# EAGLE design ledstringpower (EAGLE 9.6.2)
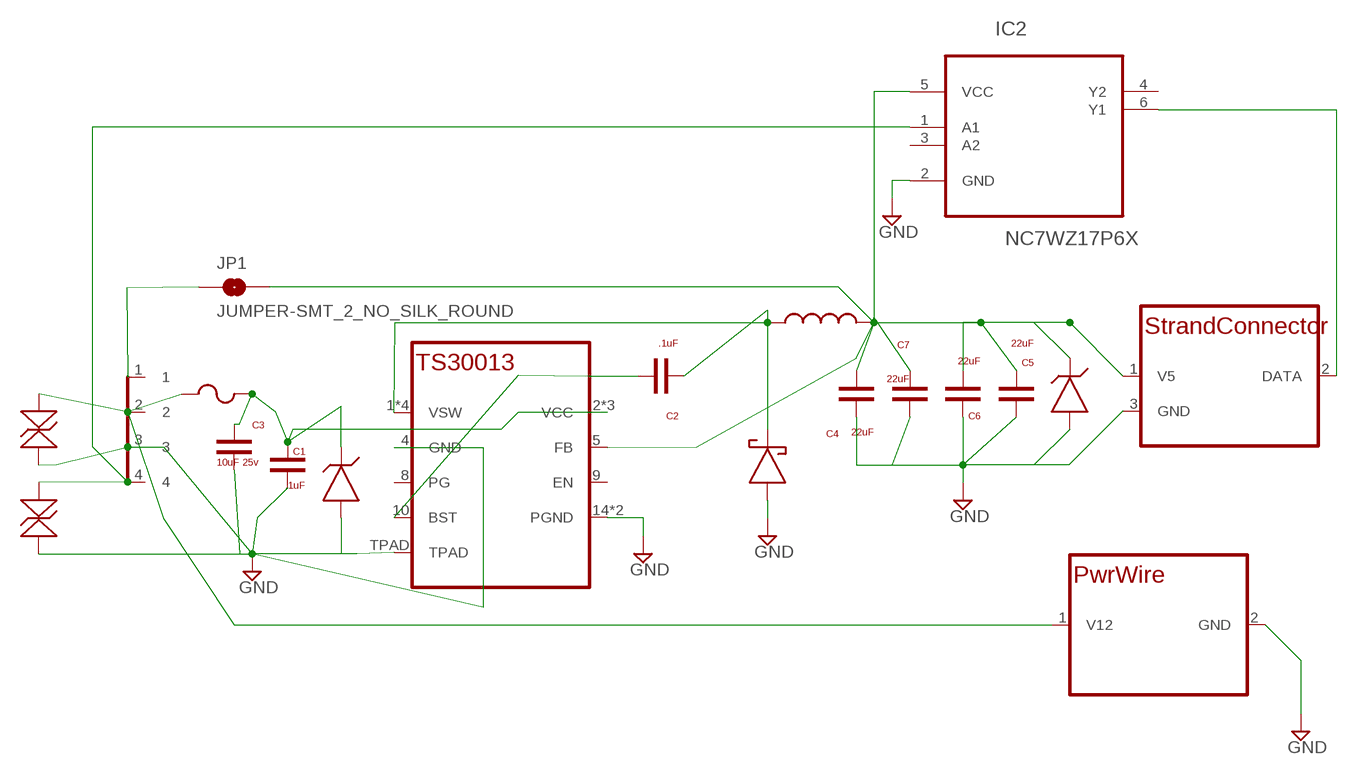
[diagram p0: schematic, sheet 1]

## Parts
C1  .1uF  CAPACITOR_NONPOLARC0603  [C0603]
C2  .1uF  CAPACITOR_NONPOLARC0603  [C0603]
C3  10uF 25v  CL31A106MAHNNNEC1206  [C1206]
C4  22uF  GRM188R61A226ME15DC0603  [C0603]
C5  22uF  GRM188R61A226ME15DC0603  [C0603]
C6  22uF  GRM188R61A226ME15DC0603  [C0603]
C7  22uF  GRM188R61A226ME15DC0603  [C0603]
D2  LS54LS54  [LS54]
F1  3A  FUSER0603  [R0603]
IC1  TS30013QFN16-3X3-DIY  [QFN16-3X3-DIY]
IC2  NC7WZ17P6X  [SOT65P210X110-6N]
JP1  JUMPER-SMT_2_NO_SILK_ROUND  [SMT-JUMPER_2_NO_SILK_ROUND]
L1  SRN5040TA-4R7MSRN5040TA  [SRN5040TA]
TVS1  DESD5V0U1BL-7BDFN1006-2  [DFN1006-2]
TVS2  DESD5V0U1BL-7BDFN1006-2  [DFN1006-2]
U$3  TE-1969806-1TE-1969806-1  [TE-1969806-1]
U$5  LEDSTRANDDLEDWIREP  [LEDWIREP]
U$8  PWRWIREDPWRWIREP  [PWRWIREP]
Z1  1SMB5930BT3G1SMB5930BT3G  [1SMB5930BT3G]
Z2  MMSZ5231BT3G-5V1-ZENERSOD123  [SOD123]

## Nets
DATA: IC2.1(A1) TVS2.2 U$3.4
GND: C1.1 C3.2 C4.1 C5.1 C6.1 C7.1 D2.1 IC1.4(GND) IC1.14(PGND) IC1.15(PGND) IC1.TPAD IC2.2(GND) TVS1.1 TVS2.1 U$3.3 U$5.3(GND) U$8.2(GND) Z1.1 Z2.1
N$1: IC2.6(Y1) U$5.2(DATA)
N$3: C2.1 D2.2 IC1.1(VSW) IC1.12(VSW) IC1.13(VSW) IC1.16(VSW) L1.1
N$5: C2.2 IC1.10(BST)
N$7: JP1.1 U$3.1
V5: C4.2 C5.2 C6.2 C7.2 IC1.5(FB) IC2.5(VCC) JP1.2 L1.2 U$5.1(V5) Z2.2
V12: F1.1 TVS1.2 U$3.2 U$8.1(V12)
VCC: C1.2 C3.1 F1.2 IC1.2(VCC) IC1.3(VCC) IC1.11(VCC) Z1.2
Unconnected: IC1.8(PG) IC1.9(EN) IC2.3(A2) IC2.4(Y2)

## Library data of the parts
C1 C2 = ledinlinesupply:CAPACITOR_NONPOLAR
C3 = ledinlinesupply:CL31A106MAHNNNE
C4-C7 = ledinlinesupply:GRM188R61A226ME15D
D2 = ledinlinesupply:LS54
F1 = ledinlinesupply:FUSE
IC1 = ledinlinesupply:TS30013
IC2 = NC7WZ17P6X_dual_schmitt_buffer:NC7WZ17P6X: Dual Buffer; MPN: NC7WZ17P6X; OC_FARNELL: 1651986; OC_NEWARK: 38C7625; PACKAGE: SC-70-6; SUPPLIER: FAIRCHILD SEMICONDUCTOR
JP1 = SparkFun-Jumpers:JUMPER-SMT_2_NO: Normally open jumper This jumper has two pads in close proximity to each other. Apply solder to close the connection. Round pads are easier to solder for beginners, but are a lot larger. SparkFun Product that uses the round pads: SparkFun EL Sequencer <https://www.sparkfun.com/products/12781>
L1 = ledinlinesupply:SRN5040TA-4R7M
TVS1 TVS2 = ledinlinesupply:DESD5V0U1BL-7B
U$3 = ledinlinesupply:TE-1969806-1
U$5 = ledinlinesupply:LEDSTRANDD
U$8 = ledinlinesupply:PWRWIRED
Z1 = ledinlinesupply:1SMB5930BT3G
Z2 = ledinlinesupply:MMSZ5231BT3G-5V1-ZENER

## Board
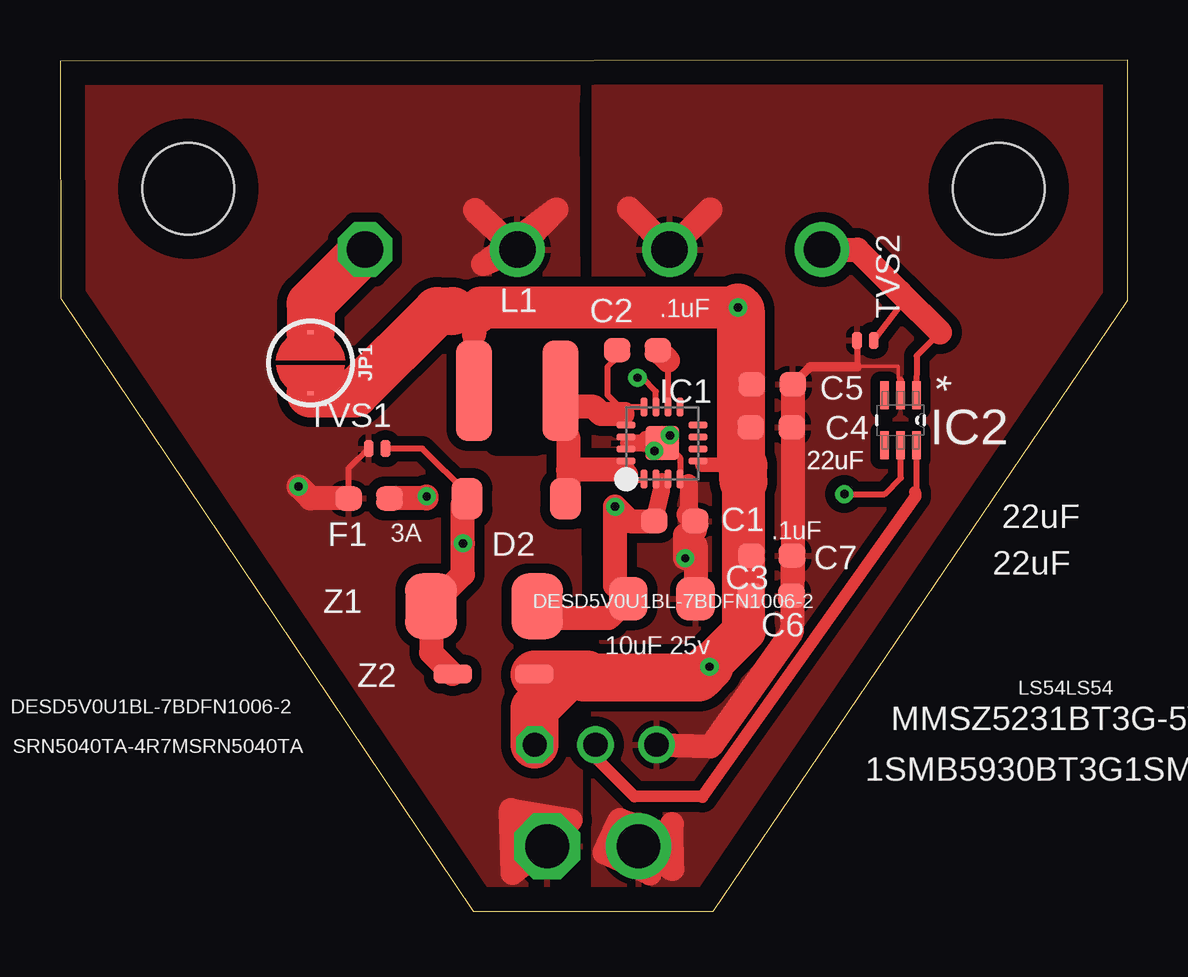
[diagram p1: board, top side]
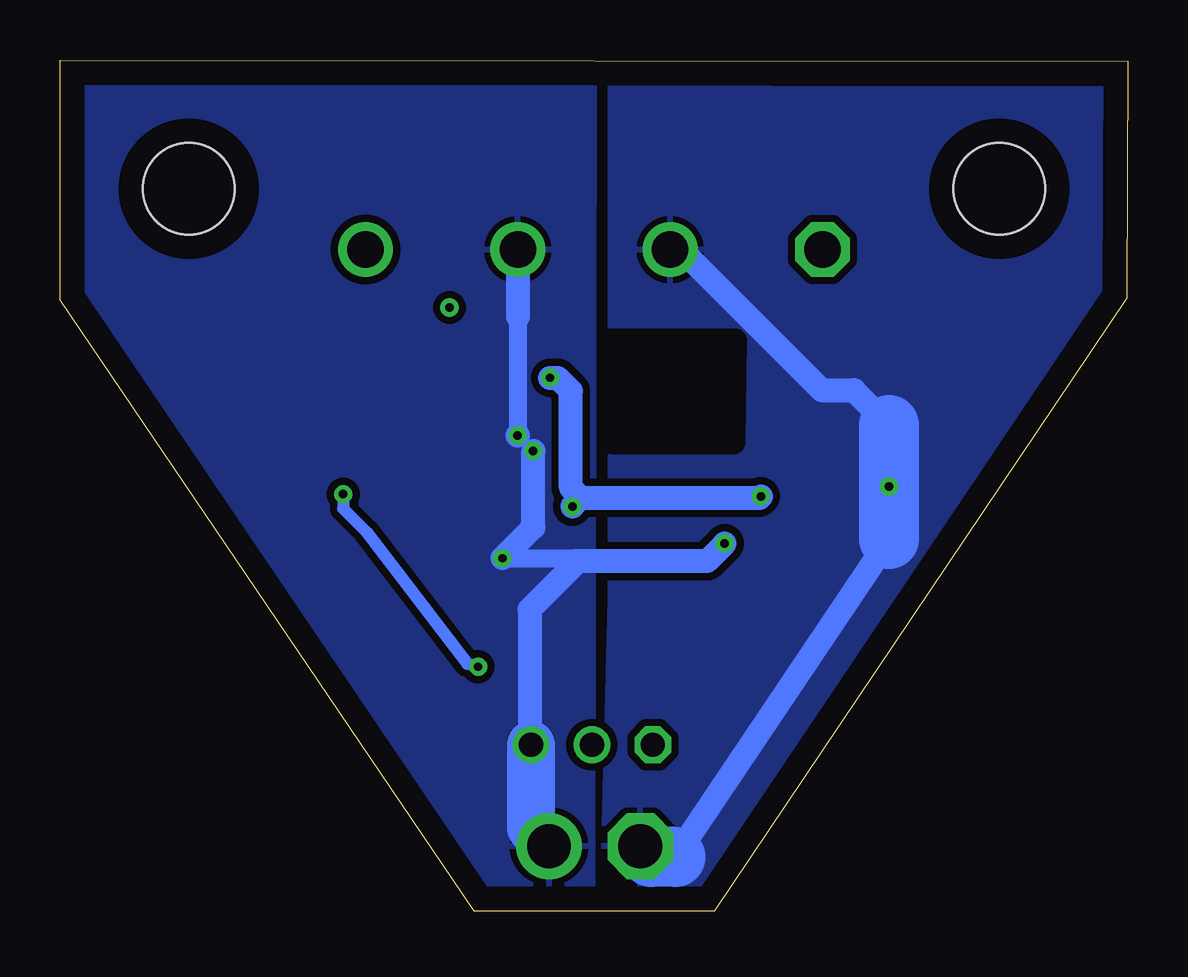
[diagram p2: board, bottom side, seen from below]

Size 44.48 x 35.47 mm. Coordinates in mm from the lower left corner, seen from the top.
Outline: 17.21,0 27.21,0 44.48,25.47 44.48,35.47 0,35.41 0.03,25.55 17.21,0
Copper layers (1*16): Top 0.035mm / dielectric 1.5mm / Bottom 0.035mm
Design rules "default": minimum track width 6mil, minimum drill 0.35mm, track to track 6mil, track to pad 6mil, pad to pad 6mil, via to via 6mil, smd to smd 6mil, copper to edge 40mil, drill to drill 6mil, minimum pad ring 10mil, minimum via ring 8mil, stop-mask expansion 4mil, vias tented up to drill 0mil, thermal gap 10mil
tRestrict: area 18.2,19.6 to 19.8,23.8
bRestrict: area 16.4,19.5 to 21.5,23.8

### Footprints (pad centres in the part's own frame; a part is rotated, then mirrored left to right if it is on the bottom)
C0603 = smd 1.1 x 1: 1 -0.85,0; 2 0.85,0
C1206 = smd 1.6 x 1.8: 1 -1.4,0; 2 1.4,0
LS54 = smd 1.3 x 1.75: 1 -2.05,0; 2 2.05,0
R0603 = smd 1.1 x 1: 1 -0.85,0; 2 0.85,0
QFN16-3X3-DIY = smd 0.8 x 0.3: 1 -1.5,0.75; 2 -1.5,0.25; 3 -1.5,-0.25; 4 -1.5,-0.75; 9 1.5,-0.75; 10 1.5,-0.25; 11 1.5,0.25; 12 1.5,0.75 | smd 0.3 x 0.8: 5 -0.75,-1.5; 6 -0.25,-1.5; 7 0.25,-1.5; 8 0.75,-1.5; 13 0.75,1.5; 14 0.25,1.5; 15 -0.25,1.5; 16 -0.75,1.5 | smd 1.4 x 1.4: TPAD 0,0
SOT65P210X110-6N = smd 1.168 x 0.356: 1 -1.041,0.66; 2 -1.041,0; 3 -1.041,-0.66; 4 1.041,-0.66; 5 1.041,0; 6 1.041,0.66
SMT-JUMPER_2_NO_SILK_ROUND = smd 0.152 x 0.305: 1 -1.27,0; 2 1.27,0
SRN5040TA = smd 1.5 x 4.2: 1 -1.8,0; 2 1.8,0
DFN1006-2 = smd 0.4 x 0.7: 1 -0.35,0; 2 0.35,0
TE-1969806-1 = drill 1.52 octagon: 1 -9.525,0 | drill 1.52: 2 -3.175,0; 3 3.175,0; 4 9.525,0 | hole 3.81: -16.89,2.54; 16.89,2.54
LEDWIREP = drill 1.016 octagon: 1 -2.54,0 | drill 1.016: 2 0,0; 3 2.54,0
PWRWIREP = drill 1.829 octagon: 1 -1.905,0 | drill 1.829: 2 1.905,0
1SMB5930BT3G = smd 2.159 x 2.743: 1 -2.21,0; 2 2.21,0
SOD123 = smd 1.6 x 0.8: 1 -1.7,0; 2 1.7,0

### Placement (x,y rotation side)
C1  25.61,16.26 180 top
C2  24.06,23.38 0 top
C3  25.08,13.03 0 top
C4  29.64,20.17 180 top
C5  29.68,21.96 180 top
C6  29.63,13.15 180 top
C7  29.65,14.82 180 top
D2  19.01,17.19 0 top
F1  12.88,17.2 0 top
IC1  25.09,19.51 90 top
IC2  35.02,20.46 270 top
JP1  10.44,22.85 270 top
L1  19.05,21.69 180 top
TVS1  13.21,19.28 180 top
TVS2  33.56,23.79 0 top
U$3  22.23,27.57 0 top
U$5  22.32,6.94 0 top
U$8  22.2,2.71 0 top
Z1  17.67,12.71 0 top
Z2  18.06,9.88 0 top

### Tracks (layer width: path | path; a pad name or v marks a point on that pad's centre or on a via)
DATA
  Top 0.25: 36.67,24.12 35.69,23.14 IC2.1 | 35,25.8 35,25.21 TVS2.2
  Top 1: U$3.4 33.22,27.57 35,25.8 36.67,24.12
GND  (via drill 0.35)
  Top 0.152: 35.01,22.15 34.92,22.24 34.92,22.72 32.56,22.72 32.52,22.68
  Top 0.2: IC1.TPAD 24.84,19.26 IC1.15
  Top 0.25: IC1.15 23.59,19.52 IC1.14 24.38,19.76 | 25.67,19.06 25.84,18.89 IC1.4 26.02,18.01 26.19,17.84 | TVS2.1 33.21,22.68 | 35.02,22.14 35.01,22.15 | D2.1 16.96,17.42 15.1,19.28 TVS1.1 | C6.1 30.48,14.8 C7.1 30.5,13.87 30.54,13.83
  Top 0.3: 35.02,22.14 IC2.2
  Top 0.4: C5.1 31.25,22.68 32.52,22.68 33.21,22.68
  Top 0.5: IC1.TPAD 24.63,19.51 24.38,19.76 24.14,19.52 23.59,19.52
  Top 0.75: 26.19,17.84 26.19,16.53
  Top 1: 26.15,15.58 26.46,15.89 C1.1 26.19,16.53 | v26.05,14.71 26.05,15.68 26.15,15.58 | D2.1 16.79,17.02 v16.79,15.33 16.79,14.04 Z1.1 15.46,10.78 Z2.1 | 26.15,15.58 26.48,15.25 C3.2 | C5.1 30.53,20.21 C4.1 30.54,20.12 30.54,13.83 | U$5.3 24.88,6.92 27.11,6.86 30.48,11.63 30.5,12.18 C7.1 | U$3.3 27.09,29.25 27.11,29.25 25.43,27.57 U$3.3 | U$3.3 23.71,29.27 23.71,29.28 25.4,27.59 U$3.3 | U$8.2 25.52,1.76 25.49,3.63 24.58,1.58 22.69,2.44 23.33,3.8 24.99,3.29 23.57,2.99 U$8.2
  Bottom 0.2: v25.41,19.83 v24.77,19.19
  Bottom 0.75: v26.05,14.71 23.02,14.71 22.9,14.59 | 25.4,24.77 v25.4,19.83 | v24.76,19.19 v24.77,19.19
  Bottom 1: U$3.3 25.4,24.77 | v16.79,15.33 v16.79,15.32 17.52,14.59 22.9,14.59 24.91,12.58 24.91,6.99 U$5.3 | v26.05,14.71 24.76,16 v24.76,19.19 | v25.4,19.83 v25.41,19.83
  Bottom 2: U$5.3 24.86,3.47 U$8.2
  pour Bottom (isolate 0.305): 22.23,35.13 22.3,0.7 27.1,0.7 44.01,25.73 44.01,35 43.68,34.98 43.03,34.98
  pour Top (isolate 0.406): 22.26,35.26 44.21,35.23 44.21,25.56 27.16,0.32 22.23,0.32
N$1
  Top 0.25: IC2.6 35.68,17.52 35.63,17.47
  Top 0.5: 35.63,17.47 35.64,17.28 26.77,4.77 23.93,4.79 22.32,6.4 U$5.2
N$3
  Top 0.25: IC1.13 23.57,20.28 23.57,20.86 23.57,21.01 IC1.12 23.32,21.01 22.81,21.52 22.81,22.68 23.21,23.08 C2.1 | IC1.16 23.59,18.2 23.59,17.99 24.32,17.99 IC1.1
  Top 0.3: 21.17,19.77 21.17,21.37 L1.1 21.52,21.02
  Top 0.7: 23.57,20.86 23.43,20.72
  Top 1: D2.2 21.17,17.3 21.17,18.39 | 21.17,19.77 21.17,18.39 | 23.43,20.72 22.55,20.72 22.25,21.02 21.52,21.02 | 23.59,18.2 23.4,18.39 21.17,18.39
N$5
  Top 0.25: IC1.10 25.34,22.95
  Top 1: 25.34,22.95 C2.2
N$7
  Top 2: U$3.1 10.44,25.3 JP1.1
V5  (via drill 0.35)
  Top 0.25: IC1.5 | 28.36,18.69 28.45,18.61 | v32.68,17.38 34.36,17.38 35.04,18.06 35.04,19.4 IC2.5 | 28.25,18.8 28.25,19.63 C4.2 28.79,21.92 C5.2 | C7.2 28.8,13.17 C6.2 28.54,11.5 27.43,10.19 v27.06,10.19
  Top 0.3: 17.06,24.3 16.35,25.01 | IC1.5 26.77,18.61
  Top 0.5: L1.2 17.25,24.84 | 17.25,24.04 L1.2 | L1.2 17.06,21.88 17.06,24.3
  Top 0.6: 26.77,18.61 28.45,18.61
  Top 0.75: 28.25,18.8 28.28,18.77 28.45,18.61 28.47,18.58
  Top 1: U$5.1 19.78,9.86 Z2.2 | 17.25,24.84 17.25,24.04
  Top 1.75: 17.25,24.84 17.57,25.16 v28.25,25.16
  Top 1.8: 28.47,17.91 28.47,11.74 28.52,11.7 27.06,10.24 v27.06,10.19
  Top 2: v28.25,25.16 28.36,25.05 28.36,18.69 | 28.47,18.58 28.47,17.92 28.47,17.91 | v27.06,10.19 26.61,9.74 21.83,9.74 21.95,9.86 21.2,9.86 | 21.2,9.86 19.78,9.86 | U$5.1 19.78,8.44 21.2,9.86 | 16.35,25.01 15.73,25.01 15.72,25.01 15.71,25.01 12.28,21.58 JP1.2
  Bottom 0.5: v27.06,10.19 27.51,10.31 31.72,15.82 32.68,16.78 v32.68,17.38
V12  (via drill 0.35)
  Top 0.25: F1.1 12.03,18.45 TVS1.2
  Top 1: F1.1 10.44,17.2 v9.94,17.7 | 17.29,29.22 U$3.2 | U$3.2 20.68,29.25 17.63,26.96 U$3.2 | U$8.1 18.86,1.6 18.79,4.22 21.27,3.79
  Bottom 1: U$3.2 18.6,27.57 12.75,21.72 11.4,21.72 9.94,20.26 | 9.94,15.51 18.84,2.27
  Bottom 2.5: 18.84,2.27 19.85,2.27 U$8.1 | 9.94,20.26 v9.94,17.7 9.94,15.51
  pour Bottom (isolate 0.305): 21.89,0.35 17.42,0.45 0.51,25.68 0.51,34.69 21.55,34.71 21.55,12.99
  pour Top (isolate 0.406): 21.65,35.07 0.34,35.07 0.34,25.66 17.35,0.3 21.69,0.3 21.54,33.53 21.54,33.55 21.64,35.06
VCC  (via drill 0.35)
  Top 0.25: IC1.3 25.09,18.01 IC1.2 | IC1.11 24.83,21.65 24.25,22.23 v24.06,22.23
  Top 0.5: 25.07,17.56 25.09,18.01
  Top 0.7: C1.2 25.07,17.56
  Top 1: F1.2 15.27,17.2 15.28,17.21 v15.28,17.29 | C1.2 23.73,16.26 v23.13,16.86 23.13,13.58 C3.1 22.86,12.21 20.38,12.21 Z1.2
  Bottom 1: 22.78,17.23 15.34,17.23 v15.28,17.29 | v24.06,22.23 23.75,22.23 23.2,21.68 23.2,17.65 22.78,17.23 | 22.78,17.23 23.13,16.88 v23.13,16.86

### Text on the board
tDocu: DATA | V5 | GND | V12 | GND
bDocu: LED Strand Power | Rev 3.1 Mar 11, 2021 | Andrew Stone | DATA | V5 | GND | V12 | GND